# EAGLE schematic Yitran_IT900_Hutschiene_PIM7A_1_1 (EAGLE 6.4)
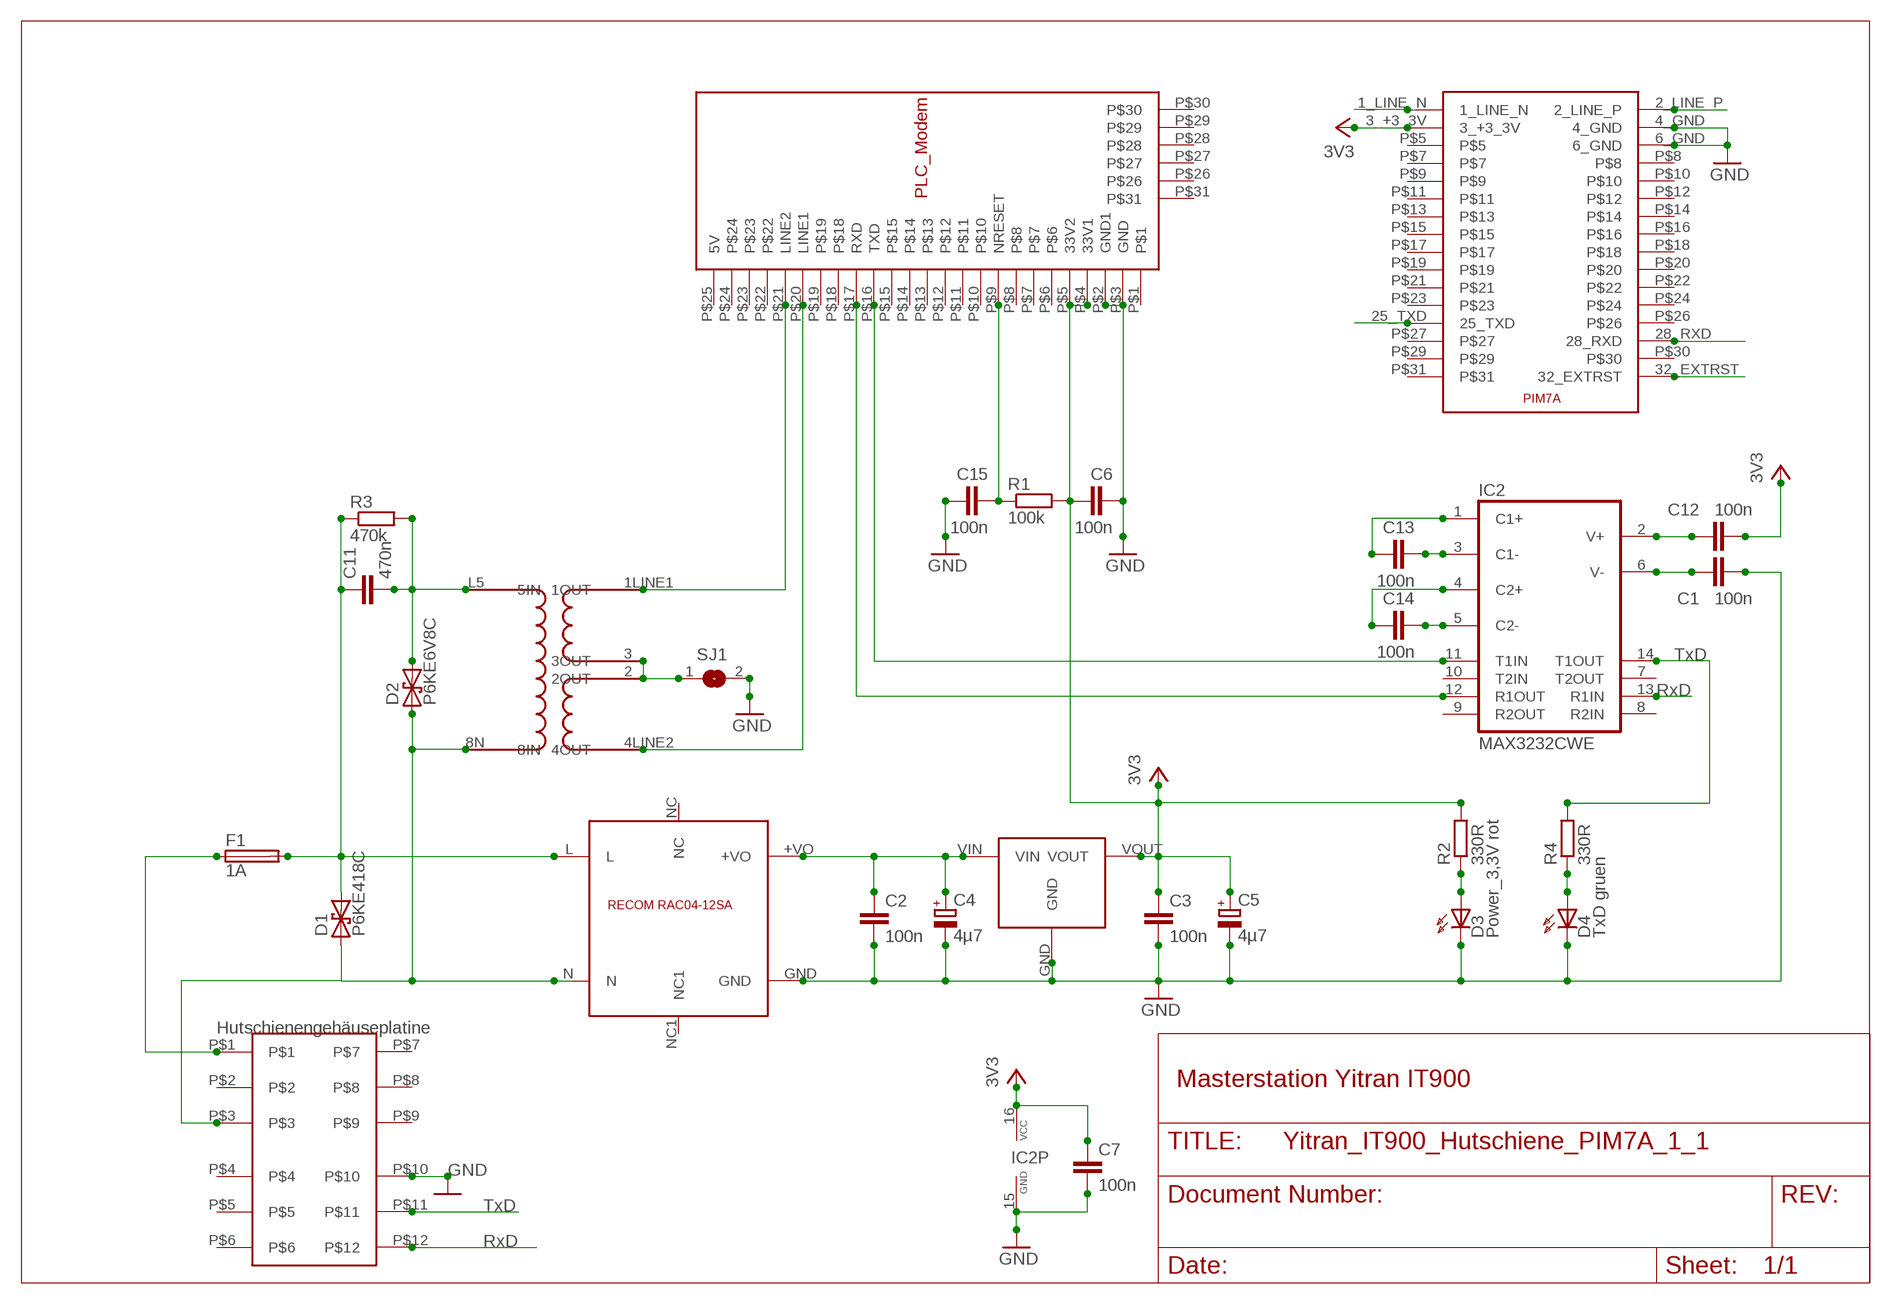
[diagram p0: schematic, sheet 1]

## Parts
C1  100n  C-EUC1206K  [C1206K]
C2  100n  C-EUC1206K  [C1206K]
C3  100n  C-EUC1206K  [C1206K]
C4  4µ7  CPOL-EUE2.5-5  [E2,5-5]
C5  4µ7  CPOL-EUE2.5-5  [E2,5-5]
C6  100n  C-EUC1206K  [C1206K]
C7  100n  C-EUC1206K  [C1206K]
C11  470n  C-EU150-091X182  [C150-091X182]
C12  100n  C-EUC1206K  [C1206K]
C13  100n  C-EUC1206K  [C1206K]
C14  100n  C-EUC1206K  [C1206K]
C15  100n  C-EUC1206K  [C1206K]
D1  P6KE418C  P6KEXXC  [CB417-15]
D2  P6KE6V8C  P6KEXXC  [CB417-15]
D3  Power_3,3V rot  HLMP6  [HLMP6]
D4  TxD gruen  HLMP6  [HLMP6]
F1  1A  TR5  [TR5]
IC2  MAX3232CWE  [SO16L]
R1  100k  R-EU_M1406  [M1406]
R2  330R  R-EU_R1206  [R1206]
R3  470k  R-EU_0309/10  [0309/10]
R4  330R  R-EU_R1206  [R1206]
SJ1  SJW  [SJW]
U$1  RECOM_783_3  RECOM_785_05  [RECOM785X]
U$2  LDG-A-12  [LDG-A-12]
U$3  MODEMSTECKER  [MODEM_FUSS]
U$4  IT900PIM7A  [IT900PIM7A]
U$9  RECOM_RAC04_12SA  [RAC04_12SA]
U$10  PLC_UEBERTRAGER_V2  [PLC-UEBERTRAGER_V2]

## Nets
3V3: C3.1 C5.+ C6.1 C7.1 C12.2 IC2.16(VCC) R1.2 R2.2 U$1.VOUT U$3.P$4(33V1) U$3.P$5(33V2) U$4.3_+3_3V
EXTRST: C15.2 R1.1 U$3.P$9(NRESET) U$4.32_EXTRST
GND: C1.2 C2.2 C3.2 C4.- C5.- C6.2 C7.2 C15.1 D3.K D4.K IC2.15(GND) SJ1.2 U$1.GND U$2.P$10 U$3.P$2(GND1) U$3.P$3(GND) U$4.4_GND U$4.6_GND U$9.GND
L: C11.1 D1.C F1.2 R3.1 U$9.L
LINE1: U$3.P$20(LINE1) U$4.1_LINE_N U$10.4LINE2(4OUT)
LINE2: U$3.P$21(LINE2) U$4.2_LINE_P U$10.1LINE1(1OUT)
N: D1.A D2.A U$2.P$3 U$9.N U$10.8N(8IN)
N$1: F1.1 U$2.P$1
N$2: C11.2 D2.C R3.2 U$10.L5(5IN)
N$3: C2.1 C4.+ U$1.VIN U$9.+VO
N$4: D3.A R2.1
N$7: C13.1 IC2.1(C1+)
N$8: C13.2 IC2.3(C1-)
N$9: C14.1 IC2.4(C2+)
N$10: C14.2 IC2.5(C2-)
N$11: C12.1 IC2.2(V+)
N$12: C1.1 IC2.6(V-)
N$13: D4.A R4.1
N$14: SJ1.1 U$10.2(2OUT) U$10.3(3OUT)
RX: IC2.12(R1OUT) U$3.P$17(RXD) U$4.28_RXD
RXD: IC2.13(R1IN) U$2.P$12
TX: IC2.11(T1IN) U$3.P$16(TXD) U$4.25_TXD
TXD: IC2.14(T1OUT) R4.2 U$2.P$11
Unconnected: IC2.7(T2OUT) IC2.8(R2IN) IC2.9(R2OUT) IC2.10(T2IN) U$2.P$2 U$2.P$4 U$2.P$5 U$2.P$6 U$2.P$7 U$2.P$8 U$2.P$9 U$3.P$1 U$3.P$6 U$3.P$7 U$3.P$8 U$3.P$10 U$3.P$11 U$3.P$12 U$3.P$13 U$3.P$14 U$3.P$15 U$3.P$18 U$3.P$19 U$3.P$22 U$3.P$23 U$3.P$24 U$3.P$25(5V) U$3.P$26 U$3.P$27 U$3.P$28 U$3.P$29 U$3.P$30 U$3.P$31 U$4.P$5 U$4.P$7 U$4.P$8 U$4.P$9 U$4.P$10 U$4.P$11 U$4.P$12 U$4.P$13 U$4.P$14 U$4.P$15 U$4.P$16 U$4.P$17 U$4.P$18 U$4.P$19 U$4.P$20 U$4.P$21 U$4.P$22 U$4.P$23 U$4.P$24 U$4.P$26 U$4.P$27 U$4.P$29 U$4.P$30 U$4.P$31 U$9.NC U$9.NC1

## Notes on the sheet
- TxD
- RxD
- Hutschienengehäuseplatine
- Masterstation Yitran IT900
- TxD
- RxD

## Library data of the parts
C1-C3 C6 C7 C11-C15 = resistor:C-EU: CAPACITOR, European symbol
C4 C5 = resistor:CPOL-EU: POLARIZED CAPACITOR, European symbol
D1 D2 = diode:P6KEXXC: DIODE transient-voltage suppressor
D3 D4 = display-hp:HLMP6: LED 2mm horizontal; MF: AGILENT TECHNOLOGIES; MPN: HLMP-6500; OC_FARNELL: 1652490; OC_NEWARK: 40K0088
F1 = fuse:TR5: FUSE Wickmann; OC_FARNELL: unknown; OC_NEWARK: unknown
IC2 = maxim:MAX3232*: True RS-232 Transceivers 3.0V to 5.5V, Low-Power up to 1Mbps, Using Four 0.1µF External Capacitors Source: http://pdfserv.maxim-ic.com/en/ds/MAX3222-MAX3241.pdf; MF: MAXIM; MPN: MAX3232CWE+; OC_FARNELL: 9725504; OC_NEWARK: 68K4630
R1-R4 = resistor:R-EU_: RESISTOR, European symbol
SJ1 = jumper:SJ: SMD solder JUMPER
U$1 = ADS:RECOM_785_05
U$2 = Erni_LDG_A_12_Leiterplatte:LDG-A-12
U$3 = ADS:MODEMSTECKER
U$4 = ADS1:IT900PIM7A
U$9 = ADS:RECOM_RAC04_12SA
U$10 = ADS:PLC_UEBERTRAGER_V2